# Altium project MSXII_SteeringWheelInterfaceBoard.PrjPcb
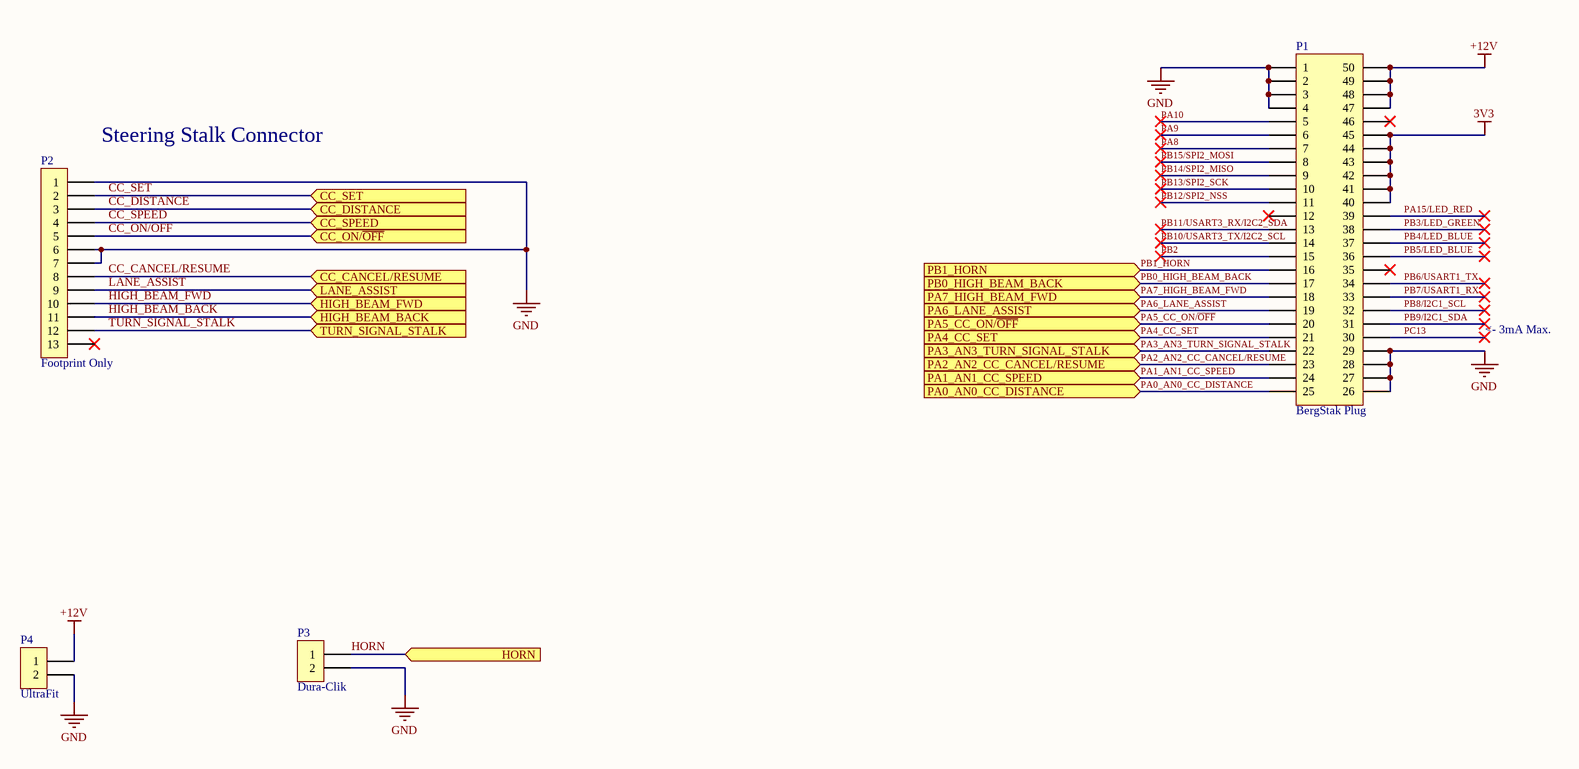
[diagram p0: Steering Wheel Carrier Board Mezzanine.SchDoc]
MSPartNumber: MS-ELE0008; ProjectAuthor: Jenny Xia; ProjectRevision: 3.1
3 sheets, 57 parts. Net scope: flat (ports and power ports of the same name join across sheets).
Board file: SteeringWheelInterfaceBoard.PcbDoc
Sheets:
  Steering Wheel Carrier Board Mezzanine.SchDoc
  Steering Wheel Interface Analog Inputs.SchDoc
  Steering Wheel Interface Digital Inputs.SchDoc

## Sheet Steering Wheel Carrier Board Mezzanine.SchDoc: Steering Wheel Interface - Mezzanine
size B; Organization: Midnight Sun Solar Rayce Car Team; Address1: University of Waterloo; Address2: 200 University Ave W; Address3: Waterloo, ON, Canada; Address4: N2L 3E9; DocumentNumber: 1; SheetNumber: 1; SheetTotal: 3; Website: www.uwmidsun.com; ProjectName: ProjectName

### Parts
P1  Series: BergStak Plug  [CONN, Bergstak 50 Pos Plug]  (hidden comment: CONN 50POS Bergstak Plug 0.02")
P2  Footprint Only  [CONN 13POS CARD EDGE]  (no BOM)
P3  Dura-Clik  [CONN, 2POS Dura-Click Vertical]
P4  Series: UltraFit  [CONN, 2POS ULTRA-FIT]  (hidden comment: CONN 2POS ULTRA-FIT 0.138")

### Ports
CC_CANCEL/RESUME (in), CC_DISTANCE (in), CC_ON/~{OFF} (in), CC_SET (in), CC_SPEED (in), HIGH_BEAM_BACK (in), HIGH_BEAM_FWD (in), HORN (in), LANE_ASSIST (in), PA0_AN0_CC_DISTANCE (in), PA1_AN1_CC_SPEED (in), PA2_AN2_CC_CANCEL/RESUME (in), PA3_AN3_TURN_SIGNAL_STALK (in), PA4_CC_SET (in), PA5_CC_ON/~{OFF} (in), PA6_LANE_ASSIST (in), PA7_HIGH_BEAM_FWD (in), PB0_HIGH_BEAM_BACK (in), PB1_HORN (in), TURN_SIGNAL_STALK (in)

### Nets
3V3: P1.40 P1.41 P1.42 P1.43 P1.44 P1.45
+12V: P1.47 P1.48 P1.49 P1.50 P4.1
GND: P1.1 P1.2 P1.3 P1.4 P1.26 P1.27 P1.28 P1.29 P2.1 P2.6 P2.7 P3.2 P4.2
CC_CANCEL/RESUME: P2.8 ; port CC_CANCEL/RESUME
CC_DISTANCE: P2.3 ; port CC_DISTANCE
CC_ON/~{OFF}: P2.5 ; port CC_ON/~{OFF}
CC_SET: P2.2 ; port CC_SET
CC_SPEED: P2.4 ; port CC_SPEED
HIGH_BEAM_BACK: P2.11 ; port HIGH_BEAM_BACK
HIGH_BEAM_FWD: P2.10 ; port HIGH_BEAM_FWD
HORN: P3.1 ; port HORN
LANE_ASSIST: P2.9 ; port LANE_ASSIST
PA0_AN0_CC_DISTANCE: P1.25 ; port PA0_AN0_CC_DISTANCE
PA1_AN1_CC_SPEED: P1.24 ; port PA1_AN1_CC_SPEED
PA2_AN2_CC_CANCEL/RESUME: P1.23 ; port PA2_AN2_CC_CANCEL/RESUME
PA3_AN3_TURN_SIGNAL_STALK: P1.22 ; port PA3_AN3_TURN_SIGNAL_STALK
PA4_CC_SET: P1.21 ; port PA4_CC_SET
PA5_CC_ON/~{OFF}: P1.20 ; port PA5_CC_ON/~{OFF}
PA6_LANE_ASSIST: P1.19 ; port PA6_LANE_ASSIST
PA7_HIGH_BEAM_FWD: P1.18 ; port PA7_HIGH_BEAM_FWD
PA8: P1.7
PA9: P1.6
PA10: P1.5
PA15/LED_RED: P1.39
PB0_HIGH_BEAM_BACK: P1.17 ; port PB0_HIGH_BEAM_BACK
PB1_HORN: P1.16 ; port PB1_HORN
PB2: P1.15
PB3/LED_GREEN: P1.38
PB4/LED_BLUE: P1.37
PB5/LED_BLUE: P1.36
PB6/USART1_TX: P1.34
PB7/USART1_RX: P1.33
PB8/I2C1_SCL: P1.32
PB9/I2C1_SDA: P1.31
PB10/USART3_TX/I2C2_SCL: P1.14
PB11/USART3_RX/I2C2_SDA: P1.13
PB12/SPI2_NSS: P1.11
PB13/SPI2_SCK: P1.10
PB14/SPI2_MISO: P1.9
PB15/SPI2_MOSI: P1.8
PC13: P1.30
TURN_SIGNAL_STALK: P2.12 ; port TURN_SIGNAL_STALK

Not connected (* = marked no-connect by the designer): P1 12* 35* 46*; P2 13*

### Notes on the sheet
- (near P2) Steering Stalk Connector
- <- 3mA Max.
- PROJECT
- DOCUMENT
- DRAWN BY
- LAST MODIFIED
- PART NUMBER
- REVISION
- SHEET
- VARIANT
- OF
- Engineering 5 - 1002
  University of Waterloo
  (519) 888-4567 x32978
  hardware@uwmidsun.com

### Library data of the parts
P1 = CONN 50POS Bergstak Plug 0.02": 50 Position Connector Plug, Outer Shroud Contacts Surface Mount Gold; Manufacturer 1: Amphenol FCI; Manufacturer Part Number 1: 10132797-055100LF; Number of Positions: 50; Mated Stacking Heights: 5mm; Pitch: 0.020" (0.50mm); Supplier 1: Digi-Key; Supplier Part Number 1: 609-5226-1-ND; Packaging: Cut Tape (CT); Part Status: Active; Connector Type: Plug, Outer Shroud Contacts; Number of Rows: 2; Mounting Type: Surface Mount; Contact Finish: Gold; Contact Finish Thickness: 1µin (0.025µm); Height Above Board: 0.169" (4.30mm); ComponentLink1URL: http://portal.fciconnect.com/Comergent//fci/drawing/10132797.pdf; ComponentLink1Description: http://portal.fciconnect.com/Comergent//fci/drawing/10132797.pdf
P2 = CONN 13POS 0.1" CARD EDGE
P3 = CONN 2POS DURA-CLIK 0.079" VERT: 2 Positions Header, Shrouded Connector 0.079" (2.00mm) Surface Mount, Vertical Tin; Manufacturer: Molex, LLC; Manufacturer Part Number: 5600200220; Style: Board to Cable/Wire; Shrouding: Shrouded - 4 Wall; Number of Positions: 2; Number of Positions Loaded: All; Mated Stacking Heights: 9.3mm; Supplier 1: Digi-Key; RoHS: RoHS Compliant; Category: Connectors, Interconnects; Stock 1: 11912; Pricing 1: 1=1.16, 10=1.012, 25=0.952, 50=0.9122, 100=0.8727, 250=0.79336 (CAD); Packaging: Cut Tape (CT); Part Status: Active; Connector Type: Header; Contact Type: Male Pin; Pitch - Mating: 0.079" (2.00mm); Number of Rows: 1; Row Spacing - Mating: -; Mounting Type: Surface Mount; Termination: Solder; Fastening Type: Latch Lock; Contact Length - Mating: -; Contact Length - Post: -; Overall Contact Length: -; Insulation Height: 0.315" (8.00mm); Contact Shape: Square; Contact Finish - Mating: Tin; Contact Finish Thickness - Mating: -; Contact Finish - Post: Tin; Contact Material: Copper Alloy; Insulation Material: Polyamide (PA), Nylon; Features: Solder Retention; Operating Temperature: -; Ingress Protection: -; Material Flammability Rating: -; Insulation Color: Natural; Current Rating: -; Voltage Rating: -; Contact Finish Thickness - Post: -; Applications: Automotive, Industrial; ComponentLink1URL: http://www.molex.com/pdm_docs/sd/5600200220_sd.pdf; ComponentLink1Description: http://www.molex.com/pdm_docs/sd/5600200220_sd.pdf; Supplier Part Number 1: WM10862CT-ND
P4 = CONN 2POS ULTRA-FIT 0.138": 2 Positions Header, Shrouded Connector 0.138" (3.50mm) Through Hole Gold; Manufacturer 1: Molex, LLC; Manufacturer Part Number 1: 1722861302; Style: Board to Board or Cable; Shrouding: Shrouded - 4 Wall; Number of Positions: 2; Number of Positions Loaded: All; Contact Length - Post: 0.126" (3.20mm); Material Flammability Rating: UL94 V-0; Mated Stacking Heights: 26.99mm; Voltage: 400V; Supplier 1: Digi-Key; Supplier Part Number 1: WM11673-ND; Packaging: Tray; Part Status: Active; Connector Type: Header; Contact Type: Male Pin; Pitch - Mating: 0.138" (3.50mm); Number of Rows: 1; Row Spacing - Mating: -; Mounting Type: Through Hole; Termination: Kinked Pin, Solder; Fastening Type: Latch Holder; Contact Length - Mating: -; Overall Contact Length: -; Insulation Height: 0.465" (11.80mm); Contact Shape: Square; Contact Finish - Mating: Gold; Contact Finish Thickness - Mating: 30µin (0.76µm); Contact Finish - Post: Tin; Contact Material: Copper Alloy; Insulation Material: Liquid Crystal Polymer (LCP); Operating Temperature: -40°C ~ 120°C; Ingress Protection: -; Insulation Color: Black; Current Rating: -; Contact Finish Thickness - Post: 60µin (1.52µm); ComponentLink1URL: http://www.molex.com/pdm_docs/sd/1722861302_sd.pdf; ComponentLink1Description: http://www.molex.com/pdm_docs/sd/1722861302_sd.pdf

## Sheet Steering Wheel Interface Analog Inputs.SchDoc: Steering Wheel Interface - Analog Inputs
size B; Organization: Midnight Sun Solar Rayce Car Team; Address1: University of Waterloo; Address2: 200 University Ave W; Address3: Waterloo, ON, Canada; Address4: N2L 3E9; DocumentNumber: 2; SheetNumber: 2; Website: www.uwmidsun.com; SheetTotal: 3; ProjectName: ProjectName
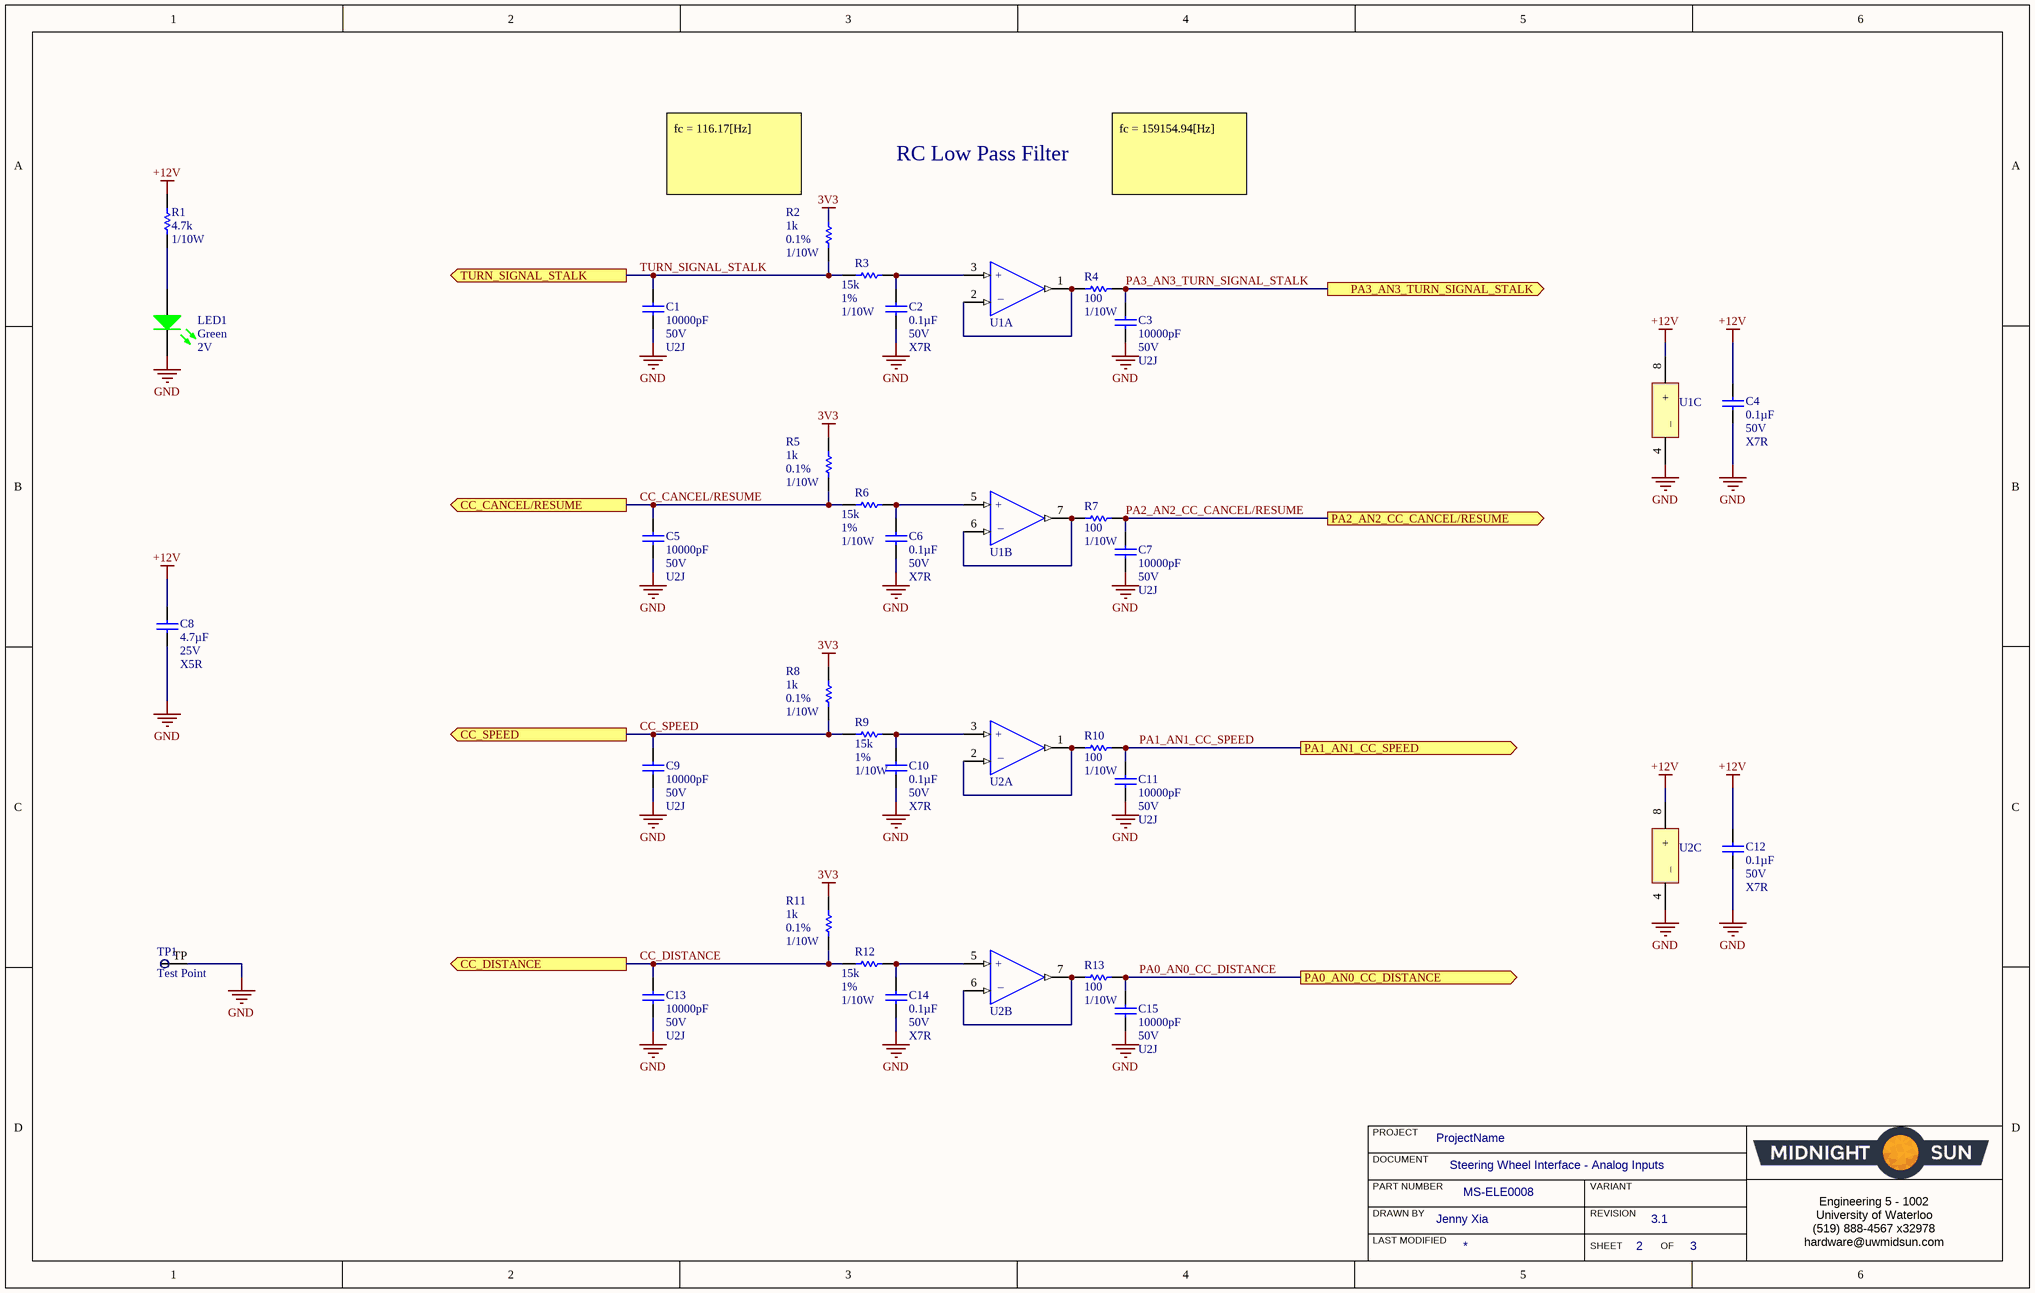
[diagram p1: Steering Wheel Interface Analog Inputs.SchDoc]

### Parts
C1  Capacitance: 10000pF  Voltage: 50V  Temperature Coefficient: U2J  [CAP, 0603]  (hidden comment: CAP CER 10nF 50V 5% X7R 0603)
C2  Capacitance: 0.1µF  Voltage: 50V  Temperature Coefficient: X7R  [CAP, 0603]  (hidden comment: CAP CER 0.1UF 50V 10% X7R 0603)
C3  Capacitance: 10000pF  Voltage: 50V  Temperature Coefficient: U2J  [CAP, 0603]  (hidden comment: CAP CER 10nF 50V 5% X7R 0603)
C4  Capacitance: 0.1µF  Voltage: 50V  Temperature Coefficient: X7R  [CAP, 0603]  (hidden comment: CAP CER 0.1UF 50V 10% X7R 0603)
C5  Capacitance: 10000pF  Voltage: 50V  Temperature Coefficient: U2J  [CAP, 0603]  (hidden comment: CAP CER 10nF 50V 5% X7R 0603)
C6  Capacitance: 0.1µF  Voltage: 50V  Temperature Coefficient: X7R  [CAP, 0603]  (hidden comment: CAP CER 0.1UF 50V 10% X7R 0603)
C7  Capacitance: 10000pF  Voltage: 50V  Temperature Coefficient: U2J  [CAP, 0603]  (hidden comment: CAP CER 10nF 50V 5% X7R 0603)
C8  Capacitance: 4.7µF  Voltage: 25V  Temperature Coefficient: X5R  [CAP, 0603]  (hidden comment: CAP CER 4.7UF 25V 10% X5R 0603)
C9  Capacitance: 10000pF  Voltage: 50V  Temperature Coefficient: U2J  [CAP, 0603]  (hidden comment: CAP CER 10nF 50V 5% X7R 0603)
C10  Capacitance: 0.1µF  Voltage: 50V  Temperature Coefficient: X7R  [CAP, 0603]  (hidden comment: CAP CER 0.1UF 50V 10% X7R 0603)
C11  Capacitance: 10000pF  Voltage: 50V  Temperature Coefficient: U2J  [CAP, 0603]  (hidden comment: CAP CER 10nF 50V 5% X7R 0603)
C12  Capacitance: 0.1µF  Voltage: 50V  Temperature Coefficient: X7R  [CAP, 0603]  (hidden comment: CAP CER 0.1UF 50V 10% X7R 0603)
C13  Capacitance: 10000pF  Voltage: 50V  Temperature Coefficient: U2J  [CAP, 0603]  (hidden comment: CAP CER 10nF 50V 5% X7R 0603)
C14  Capacitance: 0.1µF  Voltage: 50V  Temperature Coefficient: X7R  [CAP, 0603]  (hidden comment: CAP CER 0.1UF 50V 10% X7R 0603)
C15  Capacitance: 10000pF  Voltage: 50V  Temperature Coefficient: U2J  [CAP, 0603]  (hidden comment: CAP CER 10nF 50V 5% X7R 0603)
LED1  Color: Green  Voltage - Forward (Vf) (Typ): 2V  [LED_0603]  (hidden comment: LED GREEN CLEAR 2V 0603)
R1  Resistance (Ohms): 4.7k  Power (Watts): 1/10W  [RES, 0603]  (hidden comment: RES 4.7K OHM 1% 1/10W 0603)
R2  Resistance: 1k  Tolerance: 0.1%  Power Rating: 1/10W  [RES, 0603]  (hidden comment: RES SMD 1K OHM 0.1% 1/10W 0603)
R3  Resistance: 15k  Tolerance: 1%  Max Power Dissipation: 1/10W  [RES, 0603]  (hidden comment: RES SMD 15K OHM 1% 1/10W 0603)
R4  Resistance: 100  Power: 1/10W  [RES, 0603]  (hidden comment: RES 100 OHM 1% 1/10W 0603)
R5  Resistance: 1k  Tolerance: 0.1%  Power Rating: 1/10W  [RES, 0603]  (hidden comment: RES SMD 1K OHM 0.1% 1/10W 0603)
R6  Resistance: 15k  Tolerance: 1%  Max Power Dissipation: 1/10W  [RES, 0603]  (hidden comment: RES SMD 15K OHM 1% 1/10W 0603)
R7  Resistance: 100  Power: 1/10W  [RES, 0603]  (hidden comment: RES 100 OHM 1% 1/10W 0603)
R8  Resistance: 1k  Tolerance: 0.1%  Power Rating: 1/10W  [RES, 0603]  (hidden comment: RES SMD 1K OHM 0.1% 1/10W 0603)
R9  Resistance: 15k  Tolerance: 1%  Max Power Dissipation: 1/10W  [RES, 0603]  (hidden comment: RES SMD 15K OHM 1% 1/10W 0603)
R10  Resistance: 100  Power: 1/10W  [RES, 0603]  (hidden comment: RES 100 OHM 1% 1/10W 0603)
R11  Resistance: 1k  Tolerance: 0.1%  Power Rating: 1/10W  [RES, 0603]  (hidden comment: RES SMD 1K OHM 0.1% 1/10W 0603)
R12  Resistance: 15k  Tolerance: 1%  Max Power Dissipation: 1/10W  [RES, 0603]  (hidden comment: RES SMD 15K OHM 1% 1/10W 0603)
R13  Resistance: 100  Power: 1/10W  [RES, 0603]  (hidden comment: RES 100 OHM 1% 1/10W 0603)
TP1  Test Point  [Test Point]  (no BOM)
U1  IC OP AMP DUAL GP RR 10MHZ 8-VSSOP  [IC OP AMP DUAL 8-VSSOP]  (value not drawn)  (parts A,B,C of 3)
U2  IC OP AMP DUAL GP RR 10MHZ 8-VSSOP  [IC OP AMP DUAL 8-VSSOP]  (value not drawn)  (parts A,B,C of 3)

### Ports
CC_CANCEL/RESUME (out), CC_DISTANCE (out), CC_SPEED (out), PA0_AN0_CC_DISTANCE (out), PA1_AN1_CC_SPEED (out), PA2_AN2_CC_CANCEL/RESUME (out), PA3_AN3_TURN_SIGNAL_STALK (out), TURN_SIGNAL_STALK (out)

### Nets
3V3: R2.1 R5.1 R8.1 R11.1
+12V: C4.1 C8.1 C12.1 R1.1 U1.8(+) U2.8(+)
GND: C1.2 C2.2 C3.2 C4.2 C5.2 C6.2 C7.2 C8.2 C9.2 C10.2 C11.2 C12.2 C13.2 C14.2 C15.2 LED1.2(K) TP1.TP U1.4(_) U2.4(_)
CC_CANCEL/RESUME: C5.1 R5.2 R6.2 ; port CC_CANCEL/RESUME
CC_DISTANCE: C13.1 R11.2 R12.2 ; port CC_DISTANCE
CC_SPEED: C9.1 R8.2 R9.2 ; port CC_SPEED
PA0_AN0_CC_DISTANCE: C15.1 R13.1 ; port PA0_AN0_CC_DISTANCE
PA1_AN1_CC_SPEED: C11.1 R10.1 ; port PA1_AN1_CC_SPEED
PA2_AN2_CC_CANCEL/RESUME: C7.1 R7.1 ; port PA2_AN2_CC_CANCEL/RESUME
PA3_AN3_TURN_SIGNAL_STALK: C3.1 R4.1 ; port PA3_AN3_TURN_SIGNAL_STALK
TURN_SIGNAL_STALK: C1.1 R2.2 R3.2 ; port TURN_SIGNAL_STALK
NetC2_1: C2.1 R3.1 U1.3(+IN_A)
NetC6_1: C6.1 R6.1 U1.5(+IN_B)
NetC10_1: C10.1 R9.1 U2.3(+IN_A)
NetC14_1: C14.1 R12.1 U2.5(+IN_B)
NetLED1_1: LED1.1(A) R1.2
NetR4_2: R4.2 U1.1(OUT_A) U1.2(-IN_A)
NetR7_2: R7.2 U1.6(-IN_B) U1.7(OUT_B)
NetR10_2: R10.2 U2.1(OUT_A) U2.2(-IN_A)
NetR13_2: R13.2 U2.6(-IN_B) U2.7(OUT_B)

### Notes on the sheet
- RC Low Pass Filter
- (near R2) fc = 116.17[Hz]
- fc = 159154.94[Hz]
- PROJECT
- DOCUMENT
- DRAWN BY
- LAST MODIFIED
- PART NUMBER
- REVISION
- SHEET
- VARIANT
- OF
- Engineering 5 - 1002
  University of Waterloo
  (519) 888-4567 x32978
  hardware@uwmidsun.com

### Library data of the parts
C1 C3 C5 C7 C9 C11 C13 C15 = CAP CER 10nF 50V 5% X7R 0603: 10000pF ±5% 50V Ceramic Capacitor U2J 0603 (1608 Metric); Manufacturer 1: KEMET; Manufacturer Part Number 1: C0603C103J5JAC7867; Supplier 1: Digi-Key; Supplier Part Number 1: 399-13384-1-ND; Packaging: Cut Tape (CT); Part Status: Active; Operating Temperature: -55°C ~ 125°C; Ratings: -; Failure Rate: -; Mounting Type: Surface Mount, MLCC; Package / Case: 0603 (1608 Metric); Size / Dimension: 0.063" L x 0.032" W (1.60mm x 0.80mm); Height - Seated (Max): -; Thickness (Max): 0.034" (0.87mm); Lead Spacing: -; Lead Style: -; ComponentLink1URL: http://www.kemet.com/docfinder?Partnumber=C0603C103J5JAC7867; ComponentLink1Description: http://www.kemet.com/docfinder?Partnumber=C0603C103J5JAC7867; Tolerance: ±5%
C2 C4 C6 C10 C12 C14 = CAP CER 0.1UF 50V 10% X7R 0603: 0.10µF ±10% 50V Ceramic Capacitor X7R 0603 (1608 Metric); Manufacturer 1: AVX Corporation; Manufacturer Part Number 1: 06035C104KAT2A; Supplier 1: Digi-Key; Supplier Part Number 1: 478-5052-1-ND; Packaging: Cut Tape (CT); Part Status: Active; Operating Temperature: -55°C ~ 125°C; Ratings: -; Mounting Type: Surface Mount, MLCC; Package / Case: 0603 (1608 Metric); Size / Dimension: 0.063" L x 0.032" W (1.60mm x 0.81mm); Height - Seated (Max): -; Thickness (Max): 0.035" (0.90mm); Lead Spacing: -; Lead Style: -; ComponentLink1URL: http://datasheets.avx.com/X7RDielectric.pdf; ComponentLink1Description: http://datasheets.avx.com/X7RDielectric.pdf; Tolerance: ±10%
C8 = CAP CER 4.7UF 25V 10% X5R 0603: 4.7µF ±10% 25V Ceramic Capacitor X5R 0603 (1608 Metric); Manufacturer 1: Murata Electronics North America; Manufacturer Part Number 1: GRM188R61E475KE11D; Supplier 1: Digi-Key; Supplier Part Number 1: 490-7203-1-ND; Packaging: Cut Tape (CT); Part Status: Active; Operating Temperature: -55°C ~ 85°C; Ratings: -; Mounting Type: Surface Mount, MLCC; Package / Case: 0603 (1608 Metric); Size / Dimension: 0.063" L x 0.031" W (1.60mm x 0.80mm); Height - Seated (Max): -; Thickness (Max): 0.031" (0.80mm); Lead Spacing: -; Lead Style: -; ComponentLink1URL: http://www.murata.com/~/media/webrenewal/support/library/catalog/products/capacitor/mlcc/c02e.ashx; ComponentLink1Description: http://www.murata.com/~/media/webrenewal/support/library/catalog/products/capacitor/mlcc/c02e.ashx; Tolerance: ±10%
LED1 = LED GREEN CLEAR 2V 0603: Green 572nm LED Indication - Discrete 2V 0603 (1608 Metric); Manufacturer: Wurth Electronics Inc.; Manufacturer Part Number: 150060VS75000; Lens Color: Colorless; Millicandela Rating: 40mcd; Lens Style/Size: Rectangle with Flat Top, 1.10mm x 0.70mm; Current - Test: 20mA; Viewing Angle: 140°; Wavelength - Dominant: 570nm; Supplier 1: Digi-Key; RoHS: RoHS Compliant; Category: Optoelectronics; Stock 1: 9408; Pricing 1: 1=0.21, 100=0.1617, 500=0.13964 (CAD); Packaging: Cut Tape (CT); Part Status: Active; Lens Transparency: Clear; Mounting Type: Surface Mount; Wavelength - Peak: 572nm; Features: -; Package / Case: 0603 (1608 Metric); Supplier Device Package: 0603; Size / Dimension: 1.60mm L x 0.80mm W; Height (Max): 0.80mm; ComponentLink1URL: http://katalog.we-online.de/led/datasheet/150060VS75000.pdf; ComponentLink1Description: http://katalog.we-online.de/led/datasheet/150060VS75000.pdf; Supplier Part Number 1: 732-4980-1-ND
R1 = RES 4.7K OHM 1% 1/10W 0603: 4.7k Ohm ±1% 0.1W, 1/10W Chip Resistor 0603 (1608 Metric) Moisture Resistant Thick Film; Manufacturer 1: Yageo; Manufacturer Part Number 1: RC0603FR-074K7L; Description 1: RES SMD 4.7K OHM 1% 1/10W 0603; Temperature Coefficient: ±100ppm/°C; Supplier 1: Digi-Key; Supplier Part Number 1: 311-4.70KHRCT-ND; RoHS: RoHS Compliant; Category: Resistors; Stock 1: 3487566; Pricing 1: 1=0.16, 10=0.022, 100=0.0089, 1000=0.00402, 2500=0.00349 (CAD); Packaging: Cut Tape (CT); Part Status: Active; Composition: Thick Film; Features: Moisture Resistant; Operating Temperature: -55°C ~ 155°C; Package / Case: 0603 (1608 Metric); Supplier Device Package: 0603; Size / Dimension: 0.063" L x 0.031" W (1.60mm x 0.80mm); Height - Seated (Max): 0.022" (0.55mm); Failure Rate: -; ComponentLink1URL: http://www.yageo.com/documents/recent/PYu-RC_Group_51_RoHS_L_7.pdf; ComponentLink1Description: http://www.yageo.com/documents/recent/PYu-RC_Group_51_RoHS_L_7.pdf; Tolerance: ±1%
R2 R5 R8 R11 = RES SMD 1K OHM 0.1% 1/10W 0603: 1 kOhms ±0.1% 0.1W, 1/10W Chip Resistor 0603 (1608 Metric) Automotive AEC-Q200 Thin Film; Manufacturer: Panasonic; Manufacturer Part Number: ERA3AEB102V; Voltage Rating: 75V; Temperature Coefficient: 25ppm/°C; Max Power Dissipation: 100mW; ComponentLink1URL: https://www.digikey.ca/product-detail/en/panasonic-electronic-components/ERA-3AEB102V/P1.0KDBCT-ND/1466052; ComponentLink1Description: Digikey; Supplier 1: Digi-Key; Supplier Part Number 1: P1.0KDBCT-ND; RoHS: Yes; Stock 1: 1293788; Pricing 1: 1 = 0.35000, 10 = 0.30000, 100 = 0.11720, 1000 = 0.04906, 2500 = 0.04498 (USD); Mount: Surface Mount; Case/Package: 0603; Number of Pins: 2; Case Code (Metric): 1608; Case Code (Imperial): 0603; Contact Plating: Tin; Min Operating Temperature: -55°C; Max Operating Temperature: 155°C; Packaging: Tape and Reel; Package Quantity: 5000; Composition: Thin Film; Number of Terminations: 2; Termination: SMD/SMT; Military Standard: Not; Length: 1.6mm; Height: 0.45mm; Width: 0.8mm; Depth: 0.8mm; Radiation Hardening: No; REACH SVHC: No SVHC; ComponentLink2URL: http://www.farnell.com/datasheets/485442.pdf; ComponentLink2Description: http://www.farnell.com/datasheets/485442.pdf; ComponentLink3URL: http://industrial.panasonic.com/www-data/pdf/AOA0000/AOA0000CE26.pdf; ComponentLink3Description: http://industrial.panasonic.com/www-data/pdf/AOA0000/AOA0000CE26.pdf; ComponentLink4URL: http://www.farnell.com/datasheets/2052875.pdf; ComponentLink4Description: http://www.farnell.com/datasheets/2052875.pdf; ComponentLink5URL: http://www.farnell.com/datasheets/1776116.pdf; ComponentLink5Description: http://www.farnell.com/datasheets/1776116.pdf; ComponentLink6URL: http://uk.rs-online.com/webdocs/148c/0900766b8148c4ab.pdf; ComponentLink6Description: http://uk.rs-online.com/webdocs/148c/0900766b8148c4ab.pdf; ComponentLink7URL: http://www.farnell.com/datasheets/2059650.pdf; ComponentLink7Description: http://www.farnell.com/datasheets/2059650.pdf; ComponentLink8URL: http://www.produktinfo.conrad.com/datenblaetter/450000-474999/451250-da-01-en-WIDERSTAND_0603_ERA.pdf; ComponentLink8Description: http://www.produktinfo.conrad.com/datenblaetter/450000-474999/451250-da-01-en-WIDERSTAND_0603_ERA.pdf; ComponentLink9URL: http://uk.rs-online.com/webdocs/148c/0900766b8148c48a.pdf; ComponentLink9Description: http://uk.rs-online.com/webdocs/148c/0900766b8148c48a.pdf; ComponentLink10URL: https://industrial.panasonic.com/cdbs/www-data/pdf/RDM0000/AOA0000C307.pdf; ComponentLink10Description: https://industrial.panasonic.com/cdbs/www-data/pdf/RDM0000/AOA0000C307.pdf; ComponentLink11URL: http://www.alliedelec.com/m/d/b6b0537e86f421aa7f5975bb1d8f429a.pdf; ComponentLink11Description: http://www.alliedelec.com/m/d/b6b0537e86f421aa7f5975bb1d8f429a.pdf; ComponentLink12URL: http://www.produktinfo.conrad.com/datenblaetter/450000-474999/450752-da-01-en-WIDERSTAND_0603_ERA.pdf; ComponentLink12Description: http://www.produktinfo.conrad.com/datenblaetter/450000-474999/450752-da-01-en-WIDERSTAND_0603_ERA.pdf
R3 R6 R9 R12 = RES SMD 15K OHM 1% 1/10W 0603: 15 kOhms ±1% 0.1W, 1/10W Chip Resistor 0603 (1608 Metric) Moisture Resistant Thick Film; Manufacturer: Yageo; Manufacturer Part Number: RC0603FR-0715KL; Power Rating: 100mW; Voltage Rating: 50V; Temperature Coefficient: 100ppm/°C; Case/Package: 0603; Case Code (Imperial): 0603; Case Code (Metric): 1608; Min Operating Temperature: -55°C; Max Operating Temperature: 155°C; Packaging: Tape and Reel; Termination: SMD/SMT; Composition: Thick Film; Military Standard: Not; Voltage Rating (DC): 50V; Length: 1.6mm; Height: 0.022inch; Width: 0.031inch; Depth: 0.8mm; Lead Free: Lead Free; ComponentLink1URL: https://www.digikey.ca/product-detail/en/yageo/RC0603FR-0715KL/311-15.0KHRCT-ND/729900; ComponentLink1Description: Digikey; Features: Moisture Resistant; Number of Pins: 2; Number of Terminations: 2; Package Quantity: 1; REACH SVHC: Unknown; Supplier 1: Digi-Key; RoHS: Yes; Stock 1: 8611420; Pricing 1: 1 = 0.10000, 10 = 0.02400, 100 = 0.00970, 1000 = 0.00437, 2500 = 0.00379 (USD); ComponentLink2URL: http://www.yageo.com/documents/recent/PYu-RC_Group_51_RoHS_L_10.pdf; ComponentLink2Description: http://www.yageo.com/documents/recent/PYu-RC_Group_51_RoHS_L_10.pdf; ComponentLink3URL: http://www.yageo.com/documents/recent/PYu-RC_Group_51_RoHS_L_9.pdf; ComponentLink3Description: http://www.yageo.com/documents/recent/PYu-RC_Group_51_RoHS_L_9.pdf; ComponentLink4URL: https://www.verical.com/server-webapp/html/getDatasheet?partID=327895; ComponentLink4Description: https://www.verical.com/server-webapp/html/getDatasheet?partID=327895; Supplier Part Number 1: 311-15.0KHRCT-ND
R4 R7 R10 R13 = RES 100 OHM 1% 1/10W 0603: 100 Ohm ±1% 0.1W, 1/10W Chip Resistor 0603 (1608 Metric) Moisture Resistant Thick Film; Manufacturer 1: Yageo; Manufacturer Part Number 1: RC0603FR-07100RL; Temperature Coefficient: ±100ppm/°C; Supplier 1: Digi-Key; Supplier Part Number 1: 311-100HRCT-ND; Packaging: Cut Tape (CT); Part Status: Active; Composition: Thick Film; Operating Temperature: -55°C ~ 155°C; Package / Case: 0603 (1608 Metric); Supplier Device Package: 0603; Size / Dimension: 0.063" L x 0.031" W (1.60mm x 0.80mm); Height - Seated (Max): 0.022" (0.55mm); Failure Rate: -; ComponentLink1URL: http://www.yageo.com/documents/recent/PYu-RC_Group_51_RoHS_L_7.pdf; ComponentLink1Description: http://www.yageo.com/documents/recent/PYu-RC_Group_51_RoHS_L_7.pdf; Tolerance: ±1%
U1 U2 = IC OP AMP DUAL GP RR 10MHZ 8-VSSOP: General Purpose Amplifier 2 Circuit Rail-to-Rail 8-VSSOP; Manufacturer: Texas Instruments; Manufacturer Part Number: OPA2197IDGKR; Number of Circuits: 2; Slew Rate: 20V/µs; Input Bias Current: 5pA; Input Offset Voltage (Vos): 250uV; Operating Supply Current: 1mA; Output Current per Channel: 65mA; Supplier 1: Digi-Key; Stock 1: 2171; Pricing 1: 1=2.41, 10=2.162, 100=1.7376, 500=1.4276, 1000=1.1829 (USD); Mount: Surface Mount; Case/Package: VSSOP; Min Operating Temperature: -40°C; Max Operating Temperature: 125°C; Packaging: Tape and Reel; Gain Bandwidth Product: 10MHz; Number of Channels: 2; Lead Free: Lead Free; ComponentLink1URL: http://www.ti.com/lit/ds/symlink/opa2197.pdf; ComponentLink1Description: http://www.ti.com/lit/ds/symlink/opa2197.pdf; Supplier Part Number 1: 296-47349-1-ND

## Sheet Steering Wheel Interface Digital Inputs.SchDoc: Steering Wheel Interface - Digital Inputs
size B; Organization: Midnight Sun Solar Rayce Car Team; Address1: University of Waterloo; Address2: 200 University Ave W; Address3: Waterloo, ON, Canada; Address4: N2L 3E9; DocumentNumber: 3; SheetNumber: 3; SheetTotal: 3; Website: www.uwmidsun.com; ProjectName: ProjectName
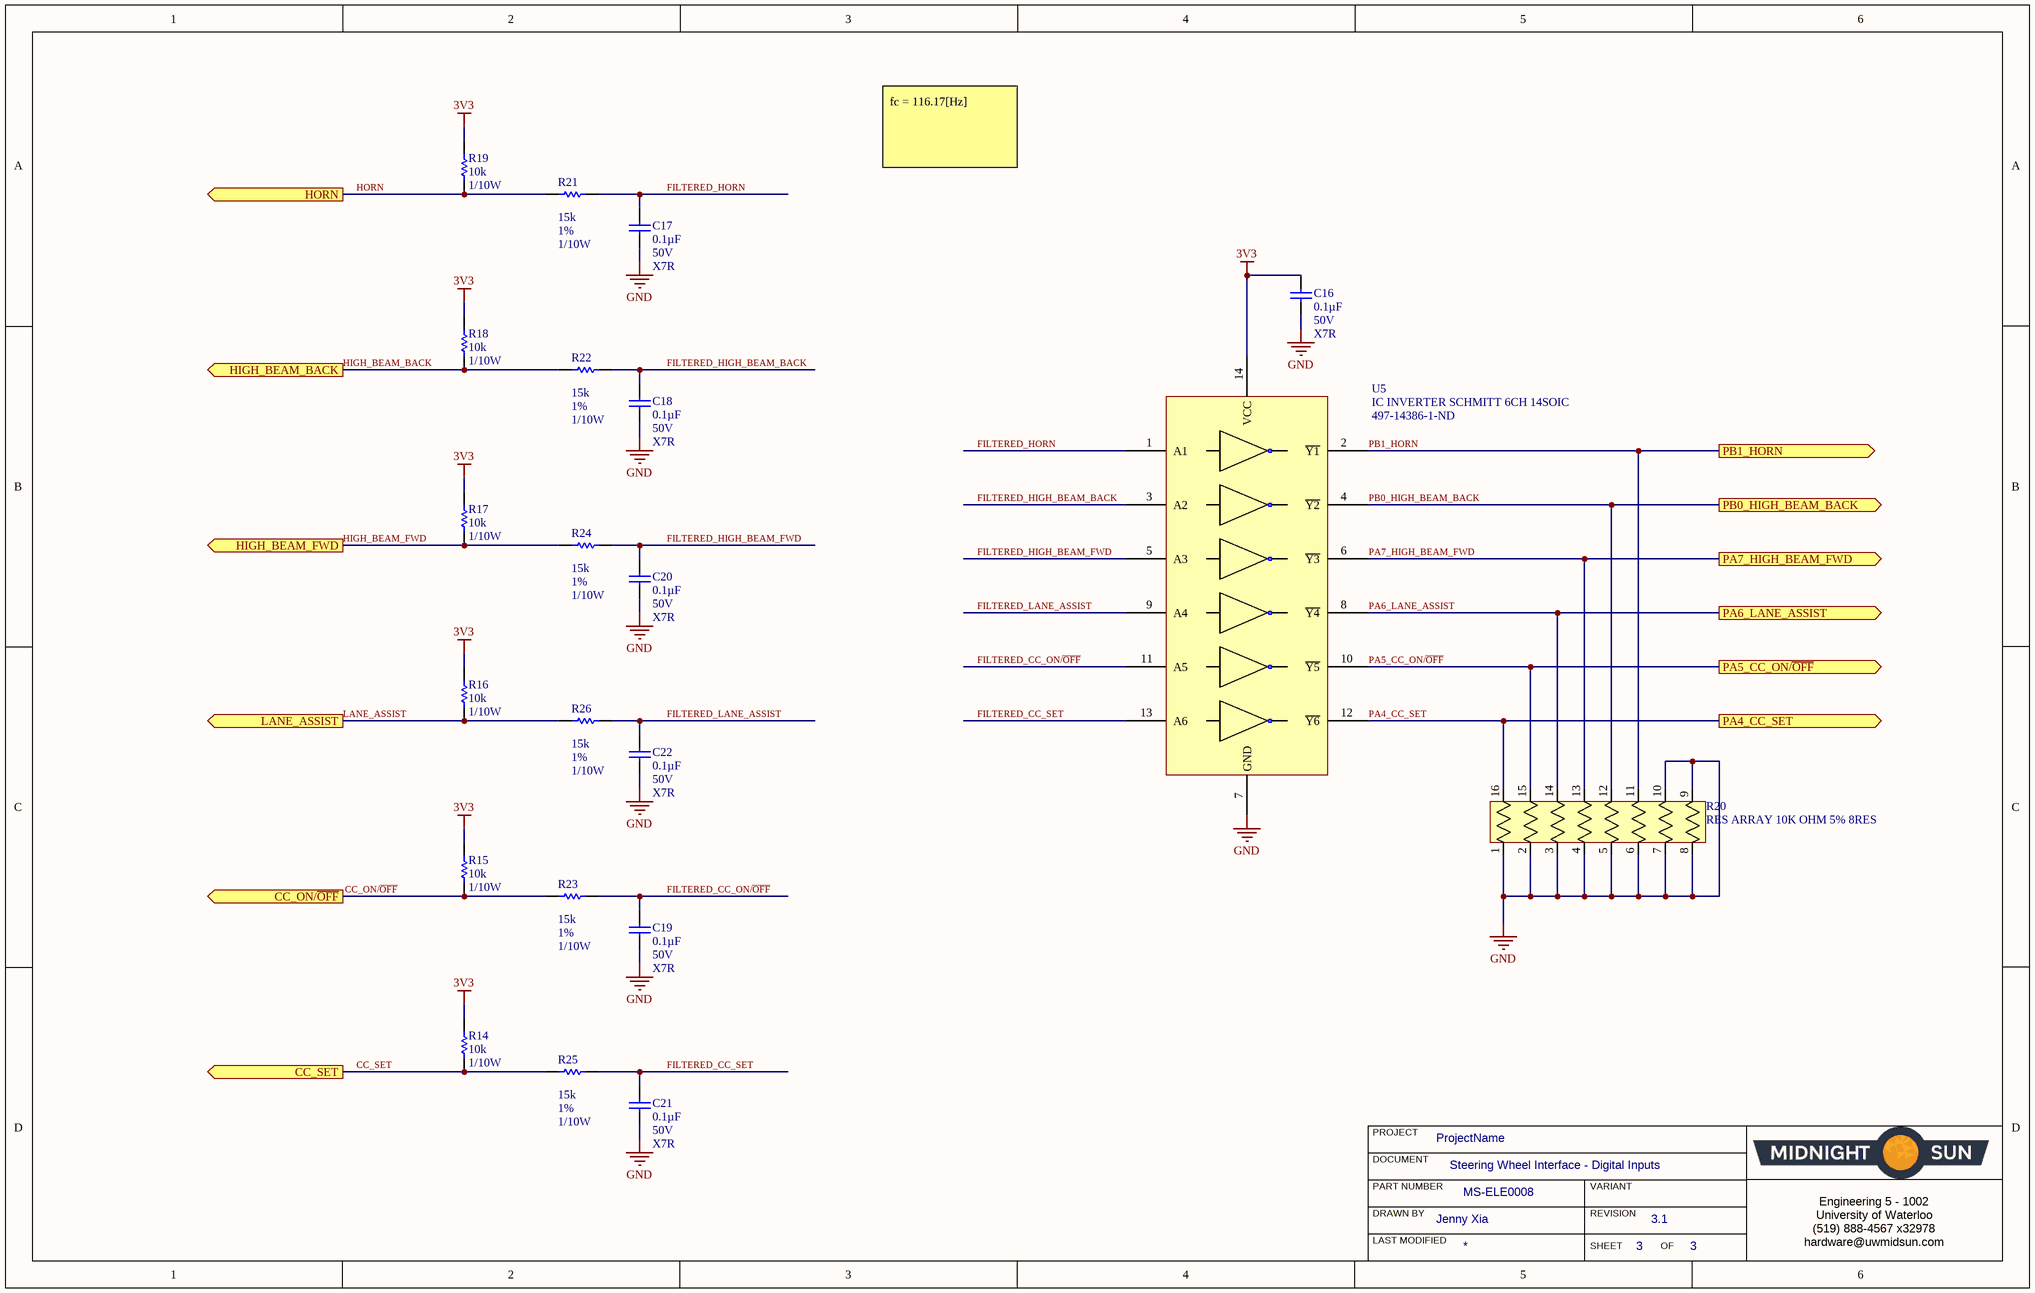
[diagram p2: Steering Wheel Interface Digital Inputs.SchDoc]

### Parts
C16  Capacitance: 0.1µF  Voltage: 50V  Temperature Coefficient: X7R  [CAP, 0603]  (hidden comment: CAP CER 0.1UF 50V 10% X7R 0603)
C17  Capacitance: 0.1µF  Voltage: 50V  Temperature Coefficient: X7R  [CAP, 0603]  (hidden comment: CAP CER 0.1UF 50V 10% X7R 0603)
C18  Capacitance: 0.1µF  Voltage: 50V  Temperature Coefficient: X7R  [CAP, 0603]  (hidden comment: CAP CER 0.1UF 50V 10% X7R 0603)
C19  Capacitance: 0.1µF  Voltage: 50V  Temperature Coefficient: X7R  [CAP, 0603]  (hidden comment: CAP CER 0.1UF 50V 10% X7R 0603)
C20  Capacitance: 0.1µF  Voltage: 50V  Temperature Coefficient: X7R  [CAP, 0603]  (hidden comment: CAP CER 0.1UF 50V 10% X7R 0603)
C21  Capacitance: 0.1µF  Voltage: 50V  Temperature Coefficient: X7R  [CAP, 0603]  (hidden comment: CAP CER 0.1UF 50V 10% X7R 0603)
C22  Capacitance: 0.1µF  Voltage: 50V  Temperature Coefficient: X7R  [CAP, 0603]  (hidden comment: CAP CER 0.1UF 50V 10% X7R 0603)
R14  Resistance: 10k  Power: 1/10W  [RES, 0603]  (hidden comment: RES 10K OHM 1% 1/10W 0603)
R15  Resistance: 10k  Power: 1/10W  [RES, 0603]  (hidden comment: RES 10K OHM 1% 1/10W 0603)
R16  Resistance: 10k  Power: 1/10W  [RES, 0603]  (hidden comment: RES 10K OHM 1% 1/10W 0603)
R17  Resistance: 10k  Power: 1/10W  [RES, 0603]  (hidden comment: RES 10K OHM 1% 1/10W 0603)
R18  Resistance: 10k  Power: 1/10W  [RES, 0603]  (hidden comment: RES 10K OHM 1% 1/10W 0603)
R19  Resistance: 10k  Power: 1/10W  [RES, 0603]  (hidden comment: RES 10K OHM 1% 1/10W 0603)
R20  RES ARRAY 10K OHM 5% 8RES  [RES ARRAY, 8 POS 1506]
R21  Resistance: 15k  Tolerance: 1%  Max Power Dissipation: 1/10W  [RES, 0603]  (hidden comment: RES SMD 15K OHM 1% 1/10W 0603)
R22  Resistance: 15k  Tolerance: 1%  Max Power Dissipation: 1/10W  [RES, 0603]  (hidden comment: RES SMD 15K OHM 1% 1/10W 0603)
R23  Resistance: 15k  Tolerance: 1%  Max Power Dissipation: 1/10W  [RES, 0603]  (hidden comment: RES SMD 15K OHM 1% 1/10W 0603)
R24  Resistance: 15k  Tolerance: 1%  Max Power Dissipation: 1/10W  [RES, 0603]  (hidden comment: RES SMD 15K OHM 1% 1/10W 0603)
R25  Resistance: 15k  Tolerance: 1%  Max Power Dissipation: 1/10W  [RES, 0603]  (hidden comment: RES SMD 15K OHM 1% 1/10W 0603)
R26  Resistance: 15k  Tolerance: 1%  Max Power Dissipation: 1/10W  [RES, 0603]  (hidden comment: RES SMD 15K OHM 1% 1/10W 0603)
U5  IC INVERTER SCHMITT 6CH 14SOIC  Supplier Part Number 1: 497-14386-1-ND  [IC INVERTER SCHMITT 6CH 14TSSOP]

### Ports
CC_ON/~{OFF} (out), CC_SET (out), HIGH_BEAM_BACK (out), HIGH_BEAM_FWD (out), HORN (out), LANE_ASSIST (out), PA4_CC_SET (out), PA5_CC_ON/~{OFF} (out), PA6_LANE_ASSIST (out), PA7_HIGH_BEAM_FWD (out), PB0_HIGH_BEAM_BACK (out), PB1_HORN (out)

### Nets
3V3: C16.1 R14.1 R15.1 R16.1 R17.1 R18.1 R19.1 U5.14(VCC)
GND: C16.2 C17.2 C18.2 C19.2 C20.2 C21.2 C22.2 R20.1 R20.2 R20.3 R20.4 R20.5 R20.6 R20.7 R20.8 R20.9 R20.10 U5.7(GND)
CC_ON/~{OFF}: R15.2 R23.2 ; port CC_ON/~{OFF}
CC_SET: R14.2 R25.2 ; port CC_SET
FILTERED_CC_ON/~{OFF}: C19.1 R23.1 U5.11(A5)
FILTERED_CC_SET: C21.1 R25.1 U5.13(A6)
FILTERED_HIGH_BEAM_BACK: C18.1 R22.1 U5.3(A2)
FILTERED_HIGH_BEAM_FWD: C20.1 R24.1 U5.5(A3)
FILTERED_HORN: C17.1 R21.1 U5.1(A1)
FILTERED_LANE_ASSIST: C22.1 R26.1 U5.9(A4)
HIGH_BEAM_BACK: R18.2 R22.2 ; port HIGH_BEAM_BACK
HIGH_BEAM_FWD: R17.2 R24.2 ; port HIGH_BEAM_FWD
HORN: R19.2 R21.2 ; port HORN
LANE_ASSIST: R16.2 R26.2 ; port LANE_ASSIST
PA4_CC_SET: R20.16 U5.12(~{Y6}) ; port PA4_CC_SET
PA5_CC_ON/~{OFF}: R20.15 U5.10(~{Y5}) ; port PA5_CC_ON/~{OFF}
PA6_LANE_ASSIST: R20.14 U5.8(~{Y4}) ; port PA6_LANE_ASSIST
PA7_HIGH_BEAM_FWD: R20.13 U5.6(~{Y3}) ; port PA7_HIGH_BEAM_FWD
PB0_HIGH_BEAM_BACK: R20.12 U5.4(~{Y2}) ; port PB0_HIGH_BEAM_BACK
PB1_HORN: R20.11 U5.2(~{Y1}) ; port PB1_HORN

### Notes on the sheet
- fc = 116.17[Hz]
- PROJECT
- DOCUMENT
- DRAWN BY
- LAST MODIFIED
- PART NUMBER
- REVISION
- SHEET
- VARIANT
- OF
- Engineering 5 - 1002
  University of Waterloo
  (519) 888-4567 x32978
  hardware@uwmidsun.com

### Library data of the parts
C16-C22 = CAP CER 0.1UF 50V 10% X7R 0603: as C2 on sheet Steering Wheel Interface Analog Inputs; Supplier 1: Digi-Key; Supplier Part Number 1: 478-5052-1-ND; Packaging: Cut Tape (CT); Part Status: Active; Operating Temperature: -55°C ~ 125°C; Ratings: -; Mounting Type: Surface Mount, MLCC; Package / Case: 0603 (1608 Metric); Size / Dimension: 0.063" L x 0.032" W (1.60mm x 0.81mm); Height - Seated (Max): -; Thickness (Max): 0.035" (0.90mm); Lead Spacing: -; Lead Style: -; ComponentLink1URL: http://datasheets.avx.com/X7RDielectric.pdf; ComponentLink1Description: http://datasheets.avx.com/X7RDielectric.pdf; Tolerance: ±10%
R14-R19 = RES 10K OHM 1% 1/10W 0603: RES SMD 10K OHM 1% 1/10W 0603; Manufacturer 1: Yageo; Manufacturer Part Number 1: RC0603FR-0710KL; Temperature Coefficient: ±100ppm/°C; Supplier 1: Digi-Key; Supplier Part Number 1: 311-10.0KHRCT-ND; Packaging: Cut Tape (CT); Part Status: Active; Composition: Thick Film; Operating Temperature: -55°C ~ 155°C; Package / Case: 0603 (1608 Metric); Supplier Device Package: 0603; Size / Dimension: 0.063" L x 0.031" W (1.60mm x 0.80mm); Height - Seated (Max): 0.022" (0.55mm); Failure Rate: -; ComponentLink1URL: http://www.yageo.com/documents/recent/PYu-RC_Group_51_RoHS_L_7.pdf; ComponentLink1Description: http://www.yageo.com/documents/recent/PYu-RC_Group_51_RoHS_L_7.pdf; Tolerance: ±1%
R20 = RES ARRAY 10K OHM 5% 8RES EXB-2HV103JV: RES ARRAY SMD 10K 5% 62.5mW 1506; Manufacturer: Panasonic Electronic Components; Vendor: Panasonic; C: Copyright (C) 2015 Accelerated Designs. All rights reserved; Circuit Type: Isolated; Temperature Coefficient: ±200ppm/°C; Value: Value; Copyright: Copyright (C) 2015 Accelerated Designs. All rights reserved; Manufacturer_Part_Number: EXB-2HV103JV; Supplier 1: Digi-Key; Manufacturer Part Number: EXB-2HV103JV; RoHS: RoHS Compliant; Category: Resistors; Stock 1: 152779; Pricing 1: 1=0.43, 10=0.373, 25=0.2712, 50=0.1964, 100=0.1456, 250=0.11176, 500=0.08806, 1000=0.06096 (CAD); Packaging: Cut Tape (CT); Part Status: Active; Resistance (Ohms): 10k; Tolerance: ±5%; Power Per Element: 62.5mW; Operating Temperature: -55°C ~ 125°C; Applications: Automotive AEC-Q200; Mounting Type: Surface Mount; Package / Case: 1506, Convex, Long Side Terminals; Supplier Device Package: 1506; Size / Dimension: 0.150" L x 0.063" W (3.80mm x 1.60mm); Height - Seated (Max): 0.022" (0.55mm); ComponentLink1URL: https://industrial.panasonic.com/cdbs/www-data/pdf/AOC0000/AOC0000C14.pdf; ComponentLink1Description: https://industrial.panasonic.com/cdbs/www-data/pdf/AOC0000/AOC0000C14.pdf; Supplier Part Number 1: Y1103CT-ND
R21-R26 = RES SMD 15K OHM 1% 1/10W 0603: as R3 on sheet Steering Wheel Interface Analog Inputs; Case/Package: 0603; Case Code (Imperial): 0603; Case Code (Metric): 1608; Min Operating Temperature: -55°C; Max Operating Temperature: 155°C; Packaging: Tape and Reel; Termination: SMD/SMT; Composition: Thick Film; Military Standard: Not; Voltage Rating (DC): 50V; Length: 1.6mm; Height: 0.022inch; Width: 0.031inch; Depth: 0.8mm; Lead Free: Lead Free; ComponentLink1URL: https://www.digikey.ca/product-detail/en/yageo/RC0603FR-0715KL/311-15.0KHRCT-ND/729900; ComponentLink1Description: Digikey; Features: Moisture Resistant; Number of Pins: 2; Number of Terminations: 2; Package Quantity: 1; REACH SVHC: Unknown; Supplier 1: Digi-Key; RoHS: Yes; Stock 1: 8611420; Pricing 1: 1 = 0.10000, 10 = 0.02400, 100 = 0.00970, 1000 = 0.00437, 2500 = 0.00379 (USD); ComponentLink2URL: http://www.yageo.com/documents/recent/PYu-RC_Group_51_RoHS_L_10.pdf; ComponentLink2Description: http://www.yageo.com/documents/recent/PYu-RC_Group_51_RoHS_L_10.pdf; ComponentLink3URL: http://www.yageo.com/documents/recent/PYu-RC_Group_51_RoHS_L_9.pdf; ComponentLink3Description: http://www.yageo.com/documents/recent/PYu-RC_Group_51_RoHS_L_9.pdf; ComponentLink4URL: https://www.verical.com/server-webapp/html/getDatasheet?partID=327895; ComponentLink4Description: https://www.verical.com/server-webapp/html/getDatasheet?partID=327895; Supplier Part Number 1: 311-15.0KHRCT-ND
U5 = IC INVERTER SCHMITT 6CH 14TSSOP: Inverter IC 6 Channel Schmitt Trigger 14-SOIC; Manufacturer: STMicroelectronics; Manufacturer Part Number: M74HC14YRM13TR; Number of Inputs: 6; Propagation Delay: 21ns; Max Supply Voltage: 6V; Min Supply Voltage: 2V; Quiescent Current: 1uA; High Level Output Current: -5.2mA; Low Level Output Current: 5.2mA; Turn-On Delay Time: 190ns; ComponentLink1Description: Digikey; ComponentLink1URL: https://www.digikey.ca/product-detail/en/stmicroelectronics/M74HC14YTTR/497-14387-1-ND/4725844; Supplier 1: Digi-Key; RoHS: Yes; Stock 1: 28888; Pricing 1: 1 = 0.48000, 10 = 0.41300, 100 = 0.30860, 500 = 0.24246, 1000 = 0.18736 (USD); Mount: Surface Mount; Case/Package: SO; Number of Pins: 14; Weight: 0.009143oz; Min Operating Temperature: -40°C; Max Operating Temperature: 125°C; Packaging: Tape and Reel; Package Quantity: 2500; Logic Function: Inverter; Number of Circuits: 6; ComponentLink2URL: http://www.st.com/content/ccc/resource/technical/document/datasheet/19/a3/52/42/dd/ab/4b/46/CD00000263.pdf/files/CD00000263.pdf/jcr:content/translations/en.CD00000263.pdf; ComponentLink2Description: http://www.st.com/content/ccc/resource/technical/document/datasheet/19/a3/52/42/dd/ab/4b/46/CD00000263.pdf/files/CD00000263.pdf/jcr:content/translations/en.CD00000263.pdf; ComponentLink3URL: http://www.st.com/st-web-ui/static/active/en/resource/technical/document/datasheet/CD00000263.pdf; ComponentLink3Description: http://www.st.com/st-web-ui/static/active/en/resource/technical/document/datasheet/CD00000263.pdf; ComponentLink4Description: http://www.st.com/content/ccc/resource/technical/document/datasheet/19/a3/52/42/dd/ab/4b/46/CD00000263.pdf/files/CD00000263.pdf/jcr:content/translations/en.CD00000263.pdf?src-supplier=Digi-Key; ComponentLink4URL: http://www.st.com/content/ccc/resource/technical/document/datasheet/19/a3/52/42/dd/ab/4b/46/CD00000263.pdf/files/CD00000263.pdf/jcr:content/translations/en.CD00000263.pdf?src-supplier=Digi-Key; ComponentLink5Description: http://www.st.com/st-web-ui/static/active/en/resource/technical/document/datasheet/CD00000263.pdf?src-supplier=Avnet; ComponentLink5URL: http://www.st.com/st-web-ui/static/active/en/resource/technical/document/datasheet/CD00000263.pdf?src-supplier=Avnet; Number of Elements: 6

## Nets that join several sheets
3V3: Steering Wheel Carrier Board Mezzanine (6 pins), Steering Wheel Interface Analog Inputs (R2.1 R5.1 R8.1 R11.1), Steering Wheel Interface Digital Inputs (8 pins)
+12V: Steering Wheel Carrier Board Mezzanine (5 pins), Steering Wheel Interface Analog Inputs (6 pins)
GND: Steering Wheel Carrier Board Mezzanine (13 pins), Steering Wheel Interface Analog Inputs (19 pins), Steering Wheel Interface Digital Inputs (18 pins)
CC_CANCEL/RESUME: Steering Wheel Carrier Board Mezzanine (P2.8), Steering Wheel Interface Analog Inputs (C5.1 R5.2 R6.2)
CC_DISTANCE: Steering Wheel Carrier Board Mezzanine (P2.3), Steering Wheel Interface Analog Inputs (C13.1 R11.2 R12.2)
CC_ON/~{OFF}: Steering Wheel Carrier Board Mezzanine (P2.5), Steering Wheel Interface Digital Inputs (R15.2 R23.2)
CC_SET: Steering Wheel Carrier Board Mezzanine (P2.2), Steering Wheel Interface Digital Inputs (R14.2 R25.2)
CC_SPEED: Steering Wheel Carrier Board Mezzanine (P2.4), Steering Wheel Interface Analog Inputs (C9.1 R8.2 R9.2)
HIGH_BEAM_BACK: Steering Wheel Carrier Board Mezzanine (P2.11), Steering Wheel Interface Digital Inputs (R18.2 R22.2)
HIGH_BEAM_FWD: Steering Wheel Carrier Board Mezzanine (P2.10), Steering Wheel Interface Digital Inputs (R17.2 R24.2)
HORN: Steering Wheel Carrier Board Mezzanine (P3.1), Steering Wheel Interface Digital Inputs (R19.2 R21.2)
LANE_ASSIST: Steering Wheel Carrier Board Mezzanine (P2.9), Steering Wheel Interface Digital Inputs (R16.2 R26.2)
PA0_AN0_CC_DISTANCE: Steering Wheel Carrier Board Mezzanine (P1.25), Steering Wheel Interface Analog Inputs (C15.1 R13.1)
PA1_AN1_CC_SPEED: Steering Wheel Carrier Board Mezzanine (P1.24), Steering Wheel Interface Analog Inputs (C11.1 R10.1)
PA2_AN2_CC_CANCEL/RESUME: Steering Wheel Carrier Board Mezzanine (P1.23), Steering Wheel Interface Analog Inputs (C7.1 R7.1)
PA3_AN3_TURN_SIGNAL_STALK: Steering Wheel Carrier Board Mezzanine (P1.22), Steering Wheel Interface Analog Inputs (C3.1 R4.1)
PA4_CC_SET: Steering Wheel Carrier Board Mezzanine (P1.21), Steering Wheel Interface Digital Inputs (R20.16 U5.12)
PA5_CC_ON/~{OFF}: Steering Wheel Carrier Board Mezzanine (P1.20), Steering Wheel Interface Digital Inputs (R20.15 U5.10)
PA6_LANE_ASSIST: Steering Wheel Carrier Board Mezzanine (P1.19), Steering Wheel Interface Digital Inputs (R20.14 U5.8)
PA7_HIGH_BEAM_FWD: Steering Wheel Carrier Board Mezzanine (P1.18), Steering Wheel Interface Digital Inputs (R20.13 U5.6)
PB0_HIGH_BEAM_BACK: Steering Wheel Carrier Board Mezzanine (P1.17), Steering Wheel Interface Digital Inputs (R20.12 U5.4)
PB1_HORN: Steering Wheel Carrier Board Mezzanine (P1.16), Steering Wheel Interface Digital Inputs (R20.11 U5.2)
TURN_SIGNAL_STALK: Steering Wheel Carrier Board Mezzanine (P2.12), Steering Wheel Interface Analog Inputs (C1.1 R2.2 R3.2)